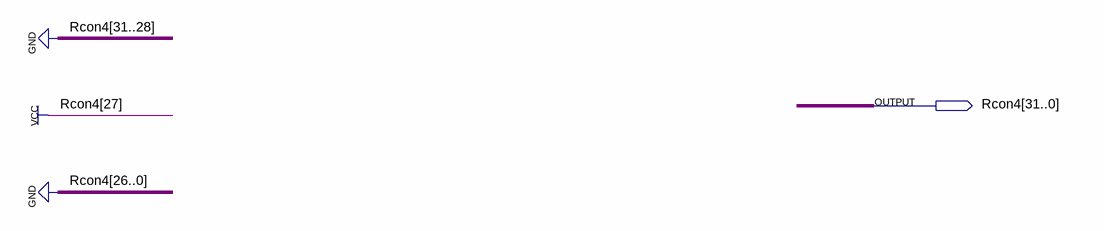
[diagram p0: schematic sheet]
// Quartus schematic Rcon4.bdf as structural Verilog: 0 symbols, 1 pins
module Rcon4 (
  output [31:0] Rcon4
);


  assign Rcon4 = 32'b00001000000000000000000000000000;
endmodule
